# Altium schematic sheet eth_a.SchDoc: XMOS XS1-L1 DP83848C Ethernet PHY Prototype
size A3
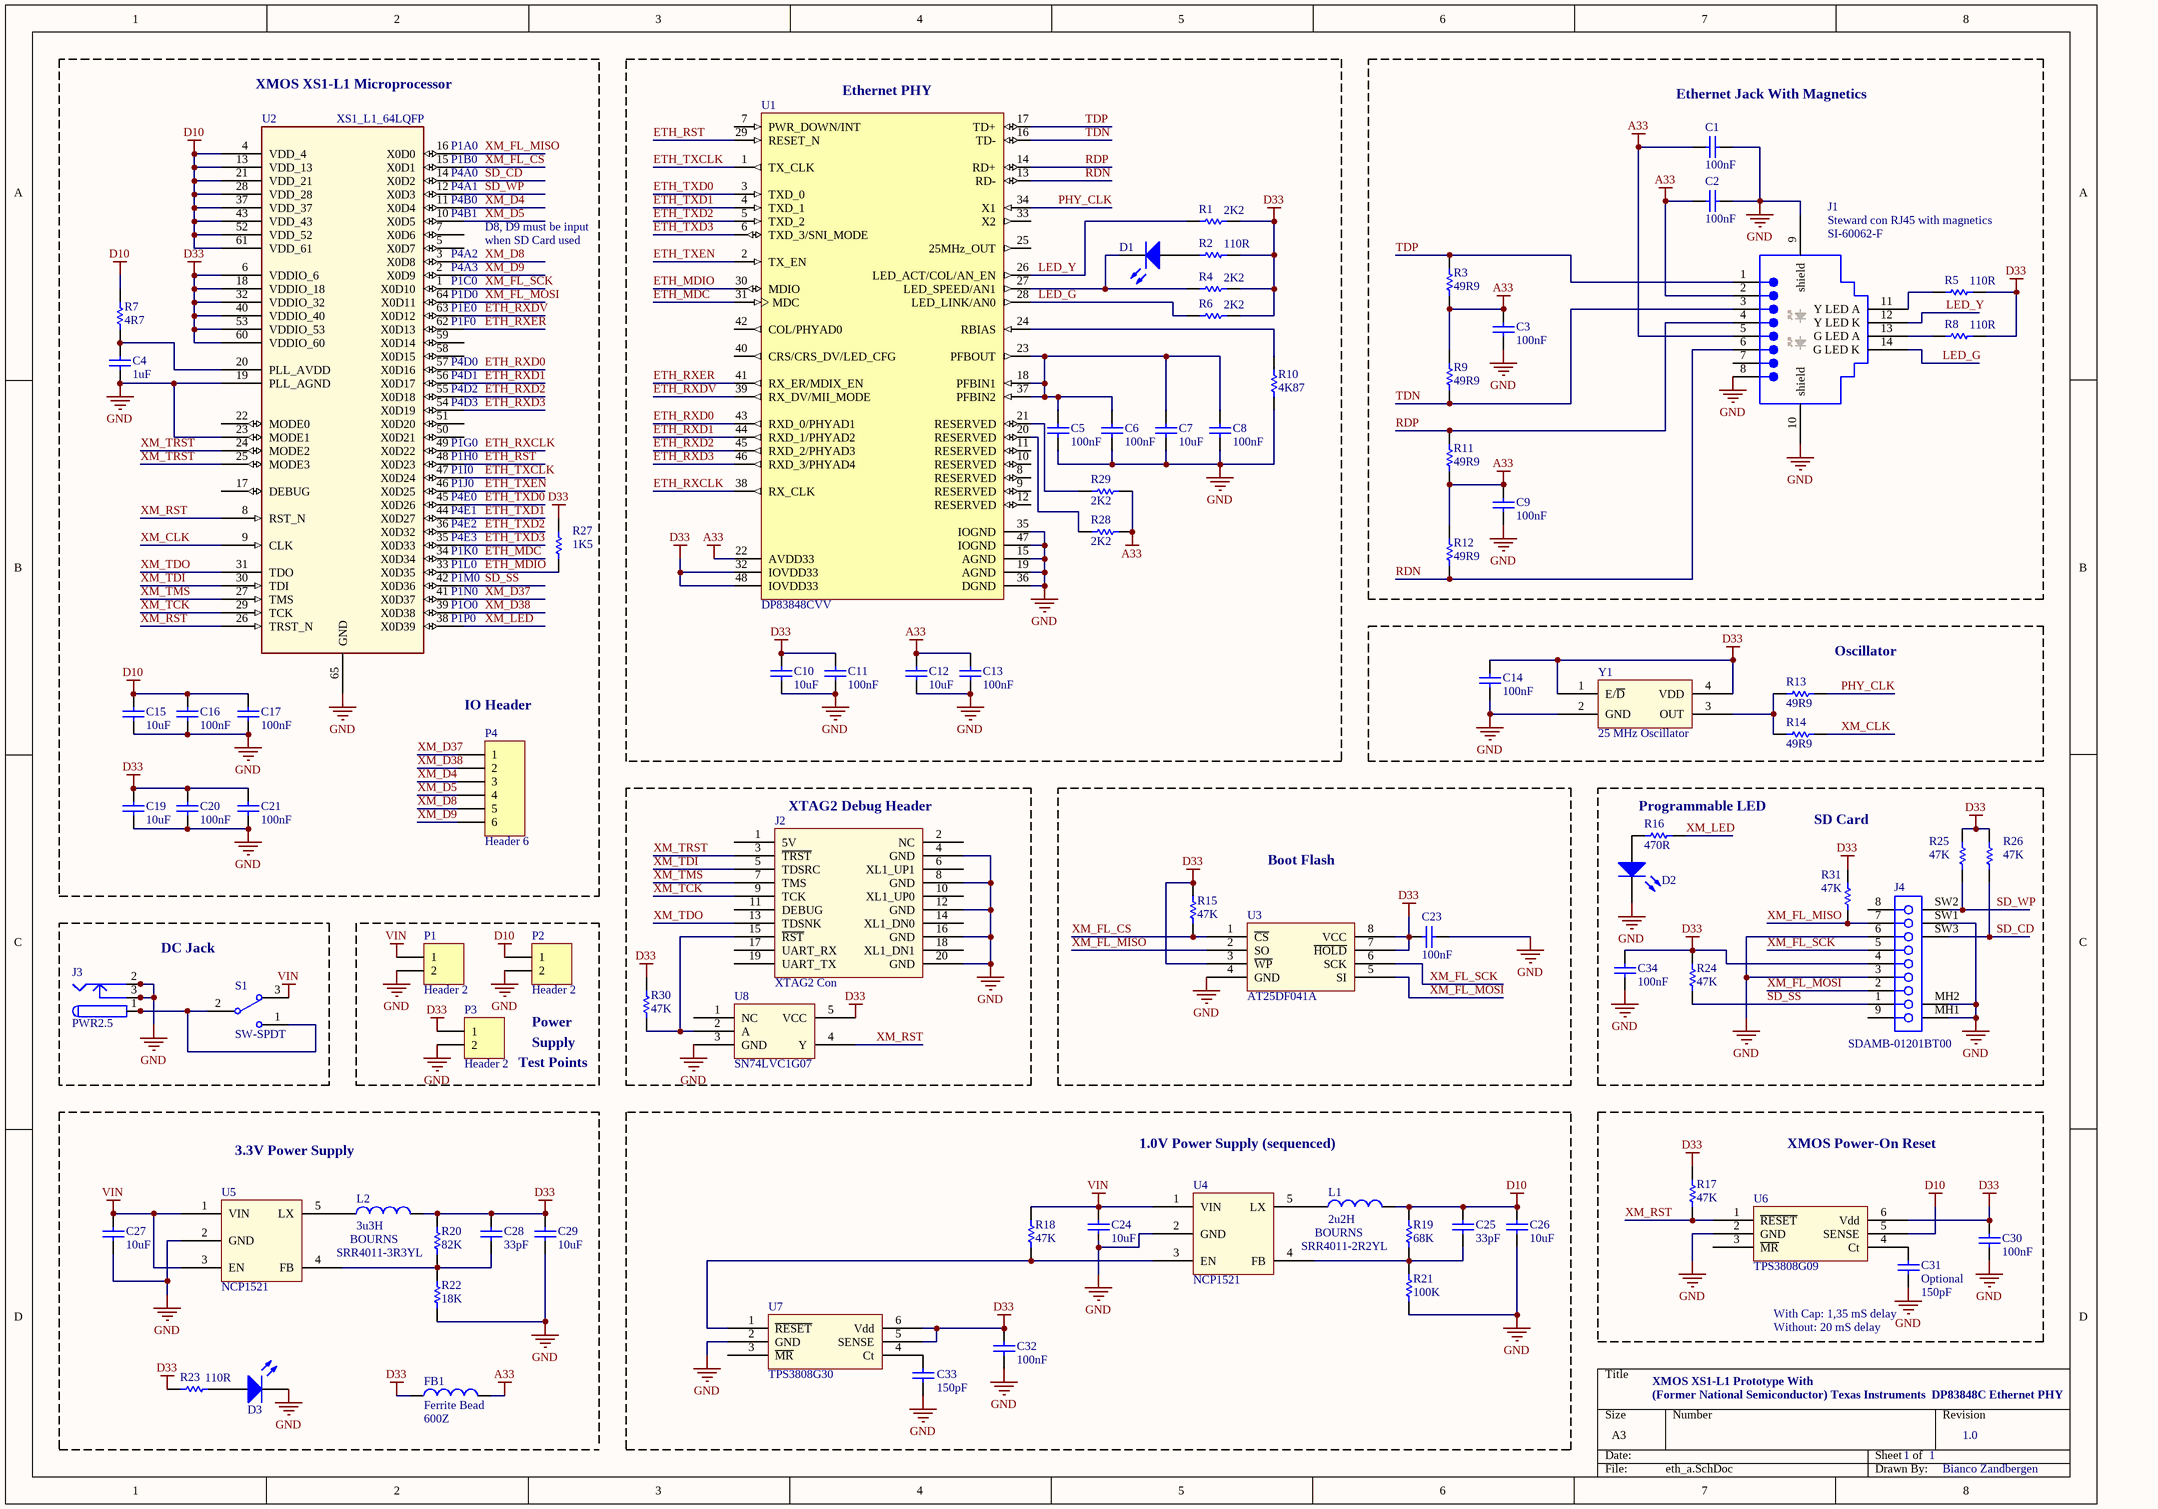
[diagram p0: eth_a.SchDoc]

## Parts
C1  value 100nF  [1608[0603]_CAP]  (hidden comment: Cap)
C2  value 100nF  [1608[0603]_CAP]  (hidden comment: Cap)
C3  value 100nF  [1608[0603]_CAP]  (hidden comment: Cap)
C4  value 1uF  [1608[0603]_CAP]  (hidden comment: Cap)
C5  value 100nF  [1608[0603]_CAP]  (hidden comment: Cap)
C6  value 100nF  [1608[0603]_CAP]  (hidden comment: Cap)
C7  value 10uF  [2012[0805]_CAP]  (hidden comment: Cap)
C8  value 100nF  [1608[0603]_CAP]  (hidden comment: Cap)
C9  value 100nF  [1608[0603]_CAP]  (hidden comment: Cap)
C10  value 10uF  [2012[0805]_CAP]  (hidden comment: Cap)
C11  value 100nF  [1608[0603]_CAP]  (hidden comment: Cap)
C12  value 10uF  [2012[0805]_CAP]  (hidden comment: Cap)
C13  value 100nF  [1608[0603]_CAP]  (hidden comment: Cap)
C14  value 100nF  [1608[0603]_CAP]  (hidden comment: Cap)
C15  value 10uF  [2012[0805]_CAP]  (hidden comment: Cap)
C16  value 100nF  [1608[0603]_CAP]  (hidden comment: Cap)
C17  value 100nF  [1608[0603]_CAP]  (hidden comment: Cap)
C19  value 10uF  [2012[0805]_CAP]  (hidden comment: Cap)
C20  value 100nF  [1608[0603]_CAP]  (hidden comment: Cap)
C21  value 100nF  [1608[0603]_CAP]  (hidden comment: Cap)
C23  value 100nF  [1608[0603]_CAP]  (hidden comment: Cap)
C24  value 10uF  [2012[0805]_CAP]  (hidden comment: Cap)
C25  value 33pF  [1608[0603]_CAP]  (hidden comment: Cap)
C26  value 10uF  [2012[0805]_CAP]  (hidden comment: Cap)
C27  value 10uF  [2012[0805]_CAP]  (hidden comment: Cap)
C28  value 33pF  [1608[0603]_CAP]  (hidden comment: Cap)
C29  value 10uF  [2012[0805]_CAP]  (hidden comment: Cap)
C30  value 100nF  [1608[0603]_CAP]  (hidden comment: Cap)
C31  Optional  value 150pF  [1608[0603]_CAP]
C32  value 100nF  [1608[0603]_CAP]  (hidden comment: Cap)
C33  value 150pF  [1608[0603]_CAP]  (hidden comment: Optional)
C34  value 100nF  [1608[0603]_CAP]  (hidden comment: Cap)
D1  LED3  [2012[0805]_LED]  (value not drawn)
D2  LED3  [2012[0805]_LED]  (value not drawn)
D3  LED3  [2012[0805]_LED]  (value not drawn)
FB1  Ferrite Bead  value 600Z  [1608[0603]_FB]
J1  Steward con RJ45 with magnetics  Details: SI-60062-F  [Steward Con RJ45]
J2  XTAG2 Con  [IDC2.54-V20D]
J3  PWR2.5  [KLD-0202]
J4  SDAMB-01201BT00  [SDCARD-SDAMB-012]
L1  value 2u2H  Manufacturer: BOURNS  ProductCode: SRR4011-2R2YL  [BOURNS_SRR4011]  (hidden comment: Inductor)
L2  value 3u3H  ProductCode: SRR4011-3R3YL  Manufacturer: BOURNS  [BOURNS_SRR4011]  (hidden comment: Inductor)
P1  Header 2  [HDR1X2]
P2  Header 2  [HDR1X2]
P3  Header 2  [HDR1X2]
P4  Header 6  [HDR1X6]
R1  value 2K2  [1608[0603]_RES]  (hidden comment: Res)
R2  value 110R  [1608[0603]_RES]  (hidden comment: Res)
R3  value 49R9  [1608[0603]_RES]  (hidden comment: Res)
R4  value 2K2  [1608[0603]_RES]  (hidden comment: Res)
R5  value 110R  [1608[0603]_RES]  (hidden comment: Res)
R6  value 2K2  [1608[0603]_RES]  (hidden comment: Res)
R7  value 4R7  [1608[0603]_RES]  (hidden comment: Res)
R8  value 110R  [1608[0603]_RES]  (hidden comment: Res)
R9  value 49R9  [1608[0603]_RES]  (hidden comment: Res)
R10  value 4K87  [1608[0603]_RES]  (hidden comment: Res)
R11  value 49R9  [1608[0603]_RES]  (hidden comment: Res)
R12  value 49R9  [1608[0603]_RES]  (hidden comment: Res)
R13  value 49R9  [1608[0603]_RES]  (hidden comment: Res)
R14  value 49R9  [1608[0603]_RES]  (hidden comment: Res)
R15  value 47K  [1608[0603]_RES]  (hidden comment: Res)
R16  value 470R  [1608[0603]_RES]  (hidden comment: Res)
R17  value 47K  [1608[0603]_RES]  (hidden comment: Res)
R18  value 47K  [1608[0603]_RES]  (hidden comment: Res)
R19  value 68K  [1608[0603]_RES]  (hidden comment: Res)
R20  value 82K  [1608[0603]_RES]  (hidden comment: Res)
R21  value 100K  [1608[0603]_RES]  (hidden comment: Res)
R22  value 18K  [1608[0603]_RES]  (hidden comment: Res)
R23  value 110R  [1608[0603]_RES]  (hidden comment: Res)
R24  value 47K  [1608[0603]_RES]  (hidden comment: Res)
R25  value 47K  [1608[0603]_RES]  (hidden comment: Res)
R26  value 47K  [1608[0603]_RES]  (hidden comment: Res)
R27  value 1K5  [1608[0603]_RES]  (hidden comment: Res)
R28  value 2K2  [1608[0603]_RES]  (hidden comment: Res)
R29  value 2K2  [1608[0603]_RES]  (hidden comment: Res)
R30  value 47K  [1608[0603]_RES]  (hidden comment: Res)
R31  value 47K  [1608[0603]_RES]  (hidden comment: Res)
S1  SW-SPDT  [SIP-3]
U1  DP83848CVV  [TSQFP50P900X900-48M]
U2  XS1_L1_64LQFP  [XMOS_QFP50P1200X1200X160-65N]
U3  AT25DF041A  [SOIC150-8_M]
U4  NCP1521  [SOT23-5]
U5  NCP1521  [SOT23-5]
U6  TPS3808G09  [SOT23-6]
U7  TPS3808G30  [SOT23-6]
U8  SN74LVC1G07  [SOT23-5]
Y1  25 MHz Oscillator  [OSC_32_50]

## Blocks framed on the sheet
Ethernet PHY: C5-C8 C10-C13 D1 R1 R2 R4 R6 R10 R28 R29 U1
Ethernet Jack With Magnetics: C1-C3 C9 J1 R3 R5 R8 R9 R11 R12
Oscillator: C14 R13 R14 Y1
XTAG2 Debug Header: J2 R30 U8
Boot Flash: C23 R15 U3
DC Jack: J3 S1
1.0V Power Supply (sequenced): C24-C26 C32 C33 L1 R18 R19 R21 U4 U7
XMOS Power-On Reset: C30 C31 R17 U6

## Nets
A33: C1.2 C2.2 C3.2 C9.2 C12.2 C13.2 FB1.2 J1.2 J1.5 R3.1 R9.2 R11.1 R12.2 R28.2 R29.2 U1.22(AVDD33)
D10: C15.2 C16.2 C17.2 C25.2 C26.2 L1.2 P2.1 R7.2 R19.2 U2.4(VDD_4) U2.13(VDD_13) U2.21(VDD_21) U2.28(VDD_28) U2.37(VDD_37) U2.43(VDD_43) U2.52(VDD_52) U2.61(VDD_61) U6.5(SENSE)
D33: C10.2 C11.2 C14.2 C19.2 C20.2 C21.2 C23.2 C28.2 C29.2 C30.2 C32.2 C34.2 FB1.1 J4.4 L2.2 P3.1 R1.2 R2.2 R4.2 R5.2 R6.2 R8.2 R15.2 R17.2 R20.2 R23.1 R24.2 R25.2 R26.2 R27.2 R30.2 R31.2 U1.32(IOVDD33) U1.48(IOVDD33) U2.6(VDDIO_6) U2.18(VDDIO_18) U2.32(VDDIO_32) U2.40(VDDIO_40) U2.53(VDDIO_53) U2.60(VDDIO_60) U3.3(~{WP}) U3.7(~{HOLD}) U3.8(VCC) U6.6(Vdd) U7.5(SENSE) U7.6(Vdd) U8.5(VCC) Y1.1(E/~{D}) Y1.4(VDD)
GND: C1.1 C2.1 C3.1 C4.1 C5.1 C6.1 C7.1 C8.1 C9.1 C10.1 C11.1 C12.1 C13.1 C14.1 C15.1 C16.1 C17.1 C19.1 C20.1 C21.1 C23.1 C24.1 C26.1 C27.1 C29.1 C30.1 C31.1 C32.1 C33.1 C34.1 D2.2(K) D3.2(K) J1.8 J1.9(shield) J1.10(shield) J2.4(GND) J2.8(GND) J2.12(GND) J2.16(GND) J2.20(GND) J3.2 J3.2A J3.2B J3.3 J3.3A J3.3B J4.3 J4.6 J4.MH1 J4.MH2 J4.SW1 P1.2 P2.2 P3.2 R10.1 R21.1 R22.1 U1.15(AGND) U1.19(AGND) U1.35(IOGND) U1.36(DGND) U1.47(IOGND) U2.19(PLL_AGND) U2.23(MODE1) U2.65(GND) U3.4(GND) U4.2(GND) U5.2(GND) U6.2(GND) U7.2(GND) U8.3(GND) Y1.2(GND)
VIN: C24.2 C27.2 P1.1 R18.2 S1.3 U4.1(VIN) U5.1(VIN) U5.3(EN)
ETH_MDC: U1.31(MDC) U2.34(X0D34)
ETH_MDIO: R27.1 U1.30(MDIO) U2.33(X0D35)
ETH_RST: U1.29(RESET_N) U2.48(X0D23)
ETH_RXCLK: U1.38(RX_CLK) U2.49(X0D22)
ETH_RXD0: U1.43(RXD_0/PHYAD1) U2.57(X0D16)
ETH_RXD1: U1.44(RXD_1/PHYAD2) U2.56(X0D17)
ETH_RXD2: U1.45(RXD_2/PHYAD3) U2.55(X0D18)
ETH_RXD3: U1.46(RXD_3/PHYAD4) U2.54(X0D19)
ETH_RXDV: U1.39(RX_DV/MII_MODE) U2.63(X0D12)
ETH_RXER: U1.41(RX_ER/MDIX_EN) U2.62(X0D13)
ETH_TXCLK: U1.1(TX_CLK) U2.47(X0D24)
ETH_TXD0: U1.3(TXD_0) U2.45(X0D26)
ETH_TXD1: U1.4(TXD_1) U2.44(X0D27)
ETH_TXD2: U1.5(TXD_2) U2.36(X0D32)
ETH_TXD3: U1.6(TXD_3/SNI_MODE) U2.35(X0D33)
ETH_TXEN: U1.2(TX_EN) U2.46(X0D25)
LED_G: J1.14(G_LED_K) R6.1 U1.28(LED_LINK/AN0)
LED_Y: J1.12(Y_LED_K) R1.1 U1.26(LED_ACT/COL/AN_EN)
PHY_CLK: R13.1 U1.34(X1)
RDN: J1.6 R12.1 U1.13(RD-)
RDP: J1.4 R11.2 U1.14(RD+)
SD_CD: J4.SW3 R26.1 U2.14(X0D2)
SD_SS: J4.1 R24.1 U2.42(X0D36)
SD_WP: J4.SW2 R25.1 U2.12(X0D3)
TDN: J1.3 R9.1 U1.16(TD-)
TDP: J1.1 R3.2 U1.17(TD+)
XM_CLK: R14.1 U2.9(CLK)
XM_D4: P4.3 U2.11(X0D4)
XM_D5: P4.4 U2.10(X0D5)
XM_D8: P4.5 U2.3(X0D8)
XM_D9: P4.6 U2.2(X0D9)
XM_D37: P4.1 U2.41(X0D37)
XM_D38: P4.2 U2.39(X0D38)
XM_FL_CS: R15.1 U2.15(X0D1) U3.1(~{CS})
XM_FL_MISO: J4.7 R31.1 U2.16(X0D0) U3.2(SO)
XM_FL_MOSI: J4.2 U2.64(X0D11) U3.5(SI)
XM_FL_SCK: J4.5 U2.1(X0D10) U3.6(SCK)
XM_LED: R16.1 U2.38(X0D39)
XM_RST: R17.1 U2.8(RST_N) U2.26(TRST_N) U6.1(~{RESET}) U8.4(Y)
XM_TCK: J2.9(TCK) U2.29(TCK)
XM_TDI: J2.5(TDSRC) U2.30(TDI)
XM_TDO: J2.13(TDSNK) U2.31(TDO)
XM_TMS: J2.7(TMS) U2.27(TMS)
XM_TRST: J2.3(~{TRST}) U2.24(MODE2) U2.25(MODE3)
NetC4_2: C4.2 R7.1 U2.20(PLL_AVDD)
NetC5_2: C5.2 C6.2 C7.2 C8.2 U1.18(PFBIN1) U1.23(PFBOUT) U1.37(PFBIN2)
NetC25_1: C25.1 R19.1 R21.2 U4.4(FB)
NetC28_1: C28.1 R20.1 R22.2 U5.4(FB)
NetC31_2: C31.2 U6.4(Ct)
NetC33_2: C33.2 U7.4(Ct)
NetD1_1: D1.1(A) R2.1
NetD1_2: D1.2(K) R4.1 U1.27(LED_SPEED/AN1)
NetD2_1: D2.1(A) R16.2
NetD3_1: D3.1(A) R23.2
NetJ1_11: J1.11(Y_LED_A) R5.1
NetJ1_13: J1.13(G_LED_A) R8.1
NetJ2_15: J2.15(~{RST}) R30.1 U8.2(A)
NetJ3_1: J3.1 J3.1A J3.1B S1.1 S1.2
NetL1_1: L1.1 U4.5(LX)
NetL2_1: L2.1 U5.5(LX)
NetR10_2: R10.2 U1.24(RBIAS)
NetR13_2: R13.2 R14.2 Y1.3(OUT)
NetR18_1: R18.1 U4.3(EN) U7.1(~{RESET})
NetR28_1: R28.1 U1.20(RESERVED)
NetR29_1: R29.1 U1.21(RESERVED)

Not connected (* = marked no-connect by the designer): J1 7; J2 1(5V) 2(NC) 6(XL1_UP1) 10(XL1_UP0) 11(DEBUG) 14(XL1_DN0) 17(UART_RX) 18(XL1_DN1) 19(UART_TX); J4 8 9; U1 7(PWR_DOWN/INT) 8(RESERVED) 9(RESERVED) 10(RESERVED) 11(RESERVED) 12(RESERVED) 25(25MHz_OUT) 33(X2) 40(CRS/CRS_DV/LED_CFG) 42(COL/PHYAD0); U2 5(X0D7) 7(X0D6) 17(DEBUG) 22(MODE0) 50(X0D21) 51(X0D20) 58(X0D15) 59(X0D14); U6 3(~{MR}); U7 3(~{MR}); U8 1(NC)

## Notes on the sheet
- XMOS XS1-L1 Microprocessor
- (near U2) P1A0
- (near U2) P1B0
- (near U2) P4A0
- (near U2) P4A1
- (near U2) P4B0
- (near U2) P4B1
- D8, D9 must be input
- when SD Card used
- (near U2) P1E0
- (near U2) P1C0
- (near U2) P1D0
- (near U2) P4A2
- (near U2) P4A3
- (near U2) P1F0
- (near U2) P4D0
- (near U2) P4D1
- (near U2) P4D2
- (near U2) P4D3
- (near U2) P1G0
- (near U2) P1H0
- (near U2) P1I0
- (near U2) P1J0
- (near U2) P4E0
- (near U2) P4E1
- (near U2) P4E2
- (near U2) P4E3
- (near U2) P1K0
- (near U2) P1L0
- (near U2) P1M0
- (near U2) P1P0
- (near U2) P1N0
- (near U2) P1O0
- IO Header
- (near R16) Programmable LED
- SD Card
- Power
- Supply
- Test Points
- 3.3V Power Supply
- (near C31) With Cap: 1,35 mS delay
- XMOS XS1-L1 Prototype With
- (Former National Semiconductor) Texas Instruments  DP83848C Ethernet PHY
- Without: 20 mS delay
- 1
- 1.0
- Bianco Zandbergen

## Library data of the parts
C1-C3 C5-C14 C17 C19-C21 C23-C27 C29 C30 C32-C34 = Cap: Capacitor; Published: 8-Jun-2000; LatestRevisionDate: 17-Jul-2002; LatestRevisionNote: Re-released for DXP Platform.; PackageReference: RAD-0.3; Publisher: Altium Limited
C4 = Cap: Capacitor; Manufacturer: KEMET; ProductCode: C0603C105K4RACTU; Vendor: Farnell; VendorCode: 1650837; Published: 8-Jun-2000; LatestRevisionDate: 17-Jul-2002; LatestRevisionNote: Re-released for DXP Platform.; PackageReference: RAD-0.3; Publisher: Altium Limited; Price: 0,17
C15 = Cap: Capacitor; Manufacturer: AVX; ProductCode: 0805ZD106KAT2A; Vendor: Farnell; VendorCode: 1833812; Published: 8-Jun-2000; LatestRevisionDate: 17-Jul-2002; LatestRevisionNote: Re-released for DXP Platform.; PackageReference: RAD-0.3; Publisher: Altium Limited; Price: 0,12
C16 = Cap: Capacitor; Manufacturer: MURATA; ProductCode: GRM188R71H104KA93D; Vendor: Farnell; VendorCode: 8820023; Published: 8-Jun-2000; LatestRevisionDate: 17-Jul-2002; LatestRevisionNote: Re-released for DXP Platform.; PackageReference: RAD-0.3; Publisher: Altium Limited; Price: 0,05
C28 = Cap: Capacitor; Manufacturer: MURATA; ProductCode: GRM1885C1H330JA01D; Vendor: Farnell; VendorCode: 1828910; Published: 8-Jun-2000; LatestRevisionDate: 17-Jul-2002; LatestRevisionNote: Re-released for DXP Platform.; PackageReference: RAD-0.3; Publisher: Altium Limited; Price: 0,03
C31 = Cap: Capacitor; Manufacturer: MURATA; ProductCode: GRM1885C1H151JA01D; Vendor: Farnell; VendorCode: 8819874; Published: 8-Jun-2000; LatestRevisionDate: 17-Jul-2002; LatestRevisionNote: Re-released for DXP Platform.; PackageReference: RAD-0.3; Publisher: Altium Limited; Price: 0,05
D1 = LED3: SMD LED 0805; Manufacturer: KINGBRIGHT; Value: ORANGE; ProductCode: KPHCM-2012SECK; Vendor: Farnell; VendorCode: 1686068; Published: 8-Jun-2000; LatestRevisionDate: 17-Dec-2003; LatestRevisionNote: PCB Footprint replaced.; DatasheetVersion: 16-Apr-2002; PackageVersion: 16-Apr-2002; PackageReference: 3.5X2.8X1.9; Publisher: Altium Limited; Price: 0,16
D2 = LED3: SMD LED 0805; Value: ORANGE; Published: 8-Jun-2000; LatestRevisionDate: 17-Dec-2003; LatestRevisionNote: PCB Footprint replaced.; DatasheetVersion: 16-Apr-2002; PackageVersion: 16-Apr-2002; PackageReference: 3.5X2.8X1.9; Publisher: Altium Limited
D3 = LED3: SMD LED 0805; Manufacturer: KINGBRIGHT; Value: GREEN; ProductCode: KPHCM-2012SGC-T; Vendor: Farnell; VendorCode: 1686074; Published: 8-Jun-2000; LatestRevisionDate: 17-Dec-2003; LatestRevisionNote: PCB Footprint replaced.; DatasheetVersion: 16-Apr-2002; PackageVersion: 16-Apr-2002; PackageReference: 3.5X2.8X1.9; Publisher: Altium Limited; Price: 0,16
FB1 = Ferrite Bead: Manufacturer: MURATA; Code_IEC: 1005; ProductCode: BLM18AG601SN1D; Vendor: Farnell; VendorCode: 1515679; Published: 8-Jun-2000; LatestRevisionDate: 29-May-2009; LatestRevisionNote: IPC-7351 Footprint Added.; PackageReference: 0402-A; Publisher: Altium Limited; PackageDescription: Chip Inductor; Code_JEITA: 0402; Price: 0,06
J1 = Steward con RJ45 with magnetics: Right Angle,RJ45-Keyed, Flange Mount PCB Jack; Manufacturer: STEWART CONNECTOR; Ports: 1; Positions/Loaded: Port1 - 8 Keyed/8; PerformanceCategory: 3; PCB_Mounting: Thru-Hole; ComponentAvailability: Obsolete; DrillSize: Nominal, Rounded to nearest 0.05mm; PCB_Layout: Complies with Manufacturer's Recommendation.; Vendor: Farnell; VendorCode: 1137983; Published: 25-Jun-2002; DatasheetDocument: 18-Dec-2001; PackageDocument: 18-Dec-2001; PackageReference: 15-43-6233; Publisher: Altium Limited; ComponentLink1Description: Manufacturer Link; ComponentLink1URL: http://www.molex.com/; ComponentLink2Description: Datasheet; ComponentLink2URL: http://www.molex.com/cmc_upload/common_files/1212003_catalogmx41314.pdf; ComponentLink3Description: Iges Model; ComponentLink3URL: http://www.molex.com/pdm_docs/igs/15-43-6233_igs.zip; ProductCode: SI-60062-F; Price: 5,21
J2 = XTAG2_CON: XTAG2 Connector; Manufacturer: TYCO; ProductCode: 2-1634688-0; Vendor: Farnell; VendorCode: 8395942; Price: 0,91
J3 = PWR2.5: Low Voltage Power Supply Connector; Manufacturer: SWITCHCRAFT; ProductCode: RAPC722X; Vendor: Farnell; VendorCode: 1608727; Published: 17-Dec-2003; DatasheetDocument: 09-May-2002; Publisher: Altium Limited; ComponentLink1Description: Manufacturer Link; ComponentLink1URL: http://domino.kycon.com/internet/Products.html; Price: 1,58
J4 = SDAMB-01201BT00: Secure Digital Card Connector, Type A without Cover; Manufacturer: MULTICOMP; PCB_Layout: Complies with manufacturer's recommendation.; Note: SD and MMC full compatible; ProductCode: SDAMB-01215BT00; Vendor: Farnell; VendorCode: 9186140; Published: 21-Sep-2007; DatasheetVersion: rev.I, 2006; PackageVersion: 2006; PackageReference: SDAMB-012; Publisher: Altium Limited; PackageDescription: SD Card without Cover, SM, 9 Position, Right Angle, Body 23.3 x 27.4 x 3.4 mm (LxWxH); ComponentLink1Description: Manufacturer Link; ComponentLink1URL: http://www.kingfont.com/; ComponentLink2Description: Datasheet; ComponentLink2URL: http://php2.twinner.com.tw/files/kingfont/SDAMB-012XXBXXX-1C.pdf; Price: 1,60
L1 = Inductor: Code_IEC: 1005; Details: BOURNS SRR4011-2R2YL; Vendor: Farnell; VendorCode: 1828153; Published: 8-Jun-2000; LatestRevisionDate: 29-May-2009; LatestRevisionNote: IPC-7351 Footprint Added.; PackageReference: 0402-A; Publisher: Altium Limited; PackageDescription: Chip Inductor; Code_JEITA: 0402; Price: 1,04
L2 = Inductor: Code_IEC: 1005; Details: BOURNS SRR4011-3R3YL; Vendor: Farnell; VendorCode: 1828154; Published: 8-Jun-2000; LatestRevisionDate: 29-May-2009; LatestRevisionNote: IPC-7351 Footprint Added.; PackageReference: 0402-A; Publisher: Altium Limited; PackageDescription: Chip Inductor; Code_JEITA: 0402; Price: 0,27
P1-P3 = Header 2: Header, 2-Pin; LatestRevisionDate: 17-Jul-2002; LatestRevisionNote: Re-released for DXP Platform.; Publisher: Altium Limited
  P1: Price: 0,00
P4 = Header 6: Header, 6-Pin; LatestRevisionDate: 17-Jul-2002; LatestRevisionNote: Re-released for DXP Platform.; Publisher: Altium Limited; Price: 0,00
R1 = Res: Resistor; Manufacturer: YAGEO; ProductCode: RE0603DR-072K2L; Vendor: Farnell; VendorCode: 1840583; Published: 8-Jun-2000; LatestRevisionDate: 17-Jul-2002; LatestRevisionNote: Re-released for DXP Platform.; PackageReference: AXIAL-0.3; Publisher: Altium Limited; Price: 0,01
R2 R4 R6 R8 R9 R11-R14 R17 R18 R23-R26 R28-R31 = Res: Resistor; Published: 8-Jun-2000; LatestRevisionDate: 17-Jul-2002; LatestRevisionNote: Re-released for DXP Platform.; PackageReference: AXIAL-0.3; Publisher: Altium Limited
R3 = Res: Resistor; Manufacturer: SUSUMU; ProductCode: RR0816Q-49R9-D-68R; Vendor: Farnell; VendorCode: 1612045; Published: 8-Jun-2000; LatestRevisionDate: 17-Jul-2002; LatestRevisionNote: Re-released for DXP Platform.; PackageReference: AXIAL-0.3; Publisher: Altium Limited; Price: 0,02
R5 = Res: Resistor; Manufacturer: PANASONIC; ProductCode: ERJ3GEYJ111V; Vendor: Farnell; VendorCode: 2059576; Published: 8-Jun-2000; LatestRevisionDate: 17-Jul-2002; LatestRevisionNote: Re-released for DXP Platform.; PackageReference: AXIAL-0.3; Publisher: Altium Limited; Price: 0,01
R7 = Res: Resistor; Manufacturer: PANASONIC; ProductCode: ERJ3GEYJ4R7V; Vendor: Farnell; VendorCode: 2059539; Published: 8-Jun-2000; LatestRevisionDate: 17-Jul-2002; LatestRevisionNote: Re-released for DXP Platform.; PackageReference: AXIAL-0.3; Publisher: Altium Limited; Price: 0,01
R10 = Res: Resistor; Manufacturer: MULTICOMP; ProductCode: MC 0.063W 0603 1%; Vendor: Farnell; VendorCode: 1170858; Published: 8-Jun-2000; LatestRevisionDate: 17-Jul-2002; LatestRevisionNote: Re-released for DXP Platform.; PackageReference: AXIAL-0.3; Publisher: Altium Limited; Price: 0,02
R15 = Res: Resistor; Manufacturer: VISHAY DRALORIC; ProductCode: CRCW060347K0FKEA; Vendor: Farnell; VendorCode: 1469811; Published: 8-Jun-2000; LatestRevisionDate: 17-Jul-2002; LatestRevisionNote: Re-released for DXP Platform.; PackageReference: AXIAL-0.3; Publisher: Altium Limited; Price: 0,02
R16 = Res: Resistor; Manufacturer: BOURNS; ProductCode: CR0603-JW-471GLF; Vendor: Farnell; VendorCode: 2008354; Published: 8-Jun-2000; LatestRevisionDate: 17-Jul-2002; LatestRevisionNote: Re-released for DXP Platform.; PackageReference: AXIAL-0.3; Publisher: Altium Limited; Price: 0,02
R19 = Res: Resistor; Manufacturer: PANASONIC; ProductCode: CRCW060368K0FKEA; Vendor: Farnell; VendorCode: 1469832; Published: 8-Jun-2000; LatestRevisionDate: 17-Jul-2002; LatestRevisionNote: Re-released for DXP Platform.; PackageReference: AXIAL-0.3; Publisher: Altium Limited; Price: 0,02
R20 = Res: Resistor; Manufacturer: VISHAY DRALORIC; ProductCode: CRCW060382K0FKEAHP; Vendor: Farnell; VendorCode: 1738930; Published: 8-Jun-2000; LatestRevisionDate: 17-Jul-2002; LatestRevisionNote: Re-released for DXP Platform.; PackageReference: AXIAL-0.3; Publisher: Altium Limited; Price: 0,04
R21 = Res: Resistor; Manufacturer: VISHAY DRALORIC; ProductCode: CRCW0603100KFKEA; Vendor: Farnell; VendorCode: 1469649; Published: 8-Jun-2000; LatestRevisionDate: 17-Jul-2002; LatestRevisionNote: Re-released for DXP Platform.; PackageReference: AXIAL-0.3; Publisher: Altium Limited; Price: 0,02
R22 = Res: Resistor; Manufacturer: VISHAY DRALORIC; ProductCode: CRCW060318K0FKEAHP; Vendor: Farnell; VendorCode: 1738921; Published: 8-Jun-2000; LatestRevisionDate: 17-Jul-2002; LatestRevisionNote: Re-released for DXP Platform.; PackageReference: AXIAL-0.3; Publisher: Altium Limited; Price: 0,04
R27 = Res: Resistor; Manufacturer: PANASONIC; ProductCode: ERJ3GEYJ152V; Vendor: Farnell; VendorCode: 2059606; Published: 8-Jun-2000; LatestRevisionDate: 17-Jul-2002; LatestRevisionNote: Re-released for DXP Platform.; PackageReference: AXIAL-0.3; Publisher: Altium Limited; Price: 0,01
S1 = SW-SPDT: SPDT Switch; Manufacturer: EAO; ProductCode: 09.03201.02; Vendor: Farnell; VendorCode: 1608080; Published: 24-Mar-1999; LatestRevisionDate: 17-Dec-2003; LatestRevisionNote: Schematic revised, PCB Footprint replaced.; DatasheetVersion: 05-Dec-2000; PackageReference: TL36WW15050; Publisher: Altium Limited; PackageDescription: Switch; 4 Leads; ComponentLink1Description: Manufacturer Link; ComponentLink1URL: http://www.apem.com; Price: 1,00
U1 = DP83848CVV: Single Port 10/100 Mb/s Ethernet PHY; Manufacturer: National Semiconductor; PackageTopMarking: NSUZXYTT*DP83848VV*VBC; PowerWise: N; CompType: Interface IC; Vendor: Farnell; VendorCode: 1286816; Published: 4-Dec-2008; DatasheetVersion: May-2008; PackageVersion: revE, May-2007; PackageReference: VBH48A; Publisher: Altium Limited; PackageDescription: LQFP, 7 x 7 x 1.4mm, 48 Lead, 0.5mm Pitch; Supplier 1: Farnell; Supplier Part Number 1: 1286816; Supplier 2: Farnell; Supplier Part Number 2: 1528379; PartNumber: DP83848CVV; RoHS: Y; PinCount: 48; ComponentLink1Description: DP83848C Datasheet; ComponentLink1URL: http://www.national.com/ds/DP/DP83848C.pdf; ComponentLink2Description: DP83848C Web Page; ComponentLink2URL: http://www.national.com/pf/DP/DP83848C.html; ComponentLink3Description: VBH48A Package Page; ComponentLink3URL: http://www.national.com/packaging/folders/vbh48a.html; ProductCode: DP83848CVV; Price: 4,89
U2 = XS1_L1_64LQFP: XMOS XS1-L1 Microprocessor; ProductCode: XS1-L01A-LQ64-C5; Vendor: Digikey; VendorCode: 880-1032-ND; Manufacturer: XMOS; Price: 6,65
U3 = AT25DF041A: 4Mbit SPI Flash; Manufacturer: ATMEL; ProductCode: AT25DF041A-SSH-B; Vendor: Farnell; VendorCode: 1715441; Price: 1,60
U4 = NCP1521: Buck Converter
U5 = NCP1521: Buck Converter; Manufacturer: ON SEMICONDUCTOR; ProductCode: NCP1521BSNT1G; Vendor: Farnell; VendorCode: 1432258; Price: 1,58
U6 = TPS3808G09: Power on Reset controller 0.9V; Manufacturer: TEXAS INSTRUMENTS; ProductCode: TPS3808G09DBVT; Vendor: Farnell; VendorCode: 1755527; Price: 2,45
U7 = TPS3808G30: Power on Reset controller 3.0V; Manufacturer: TEXAS INSTRUMENTS; ProductCode: TPS3808G30DBVT; Vendor: Farnell; VendorCode: 1755533; Price: 2,45
U8 = SN74LVC1G07: Buffer (open drain output); Manufacturer: TEXAS INSTRUMENTS; Vendor: Farnell; ProductCode: SN74LVC1G07DBV; VendorCode: 1102969; Price: 0,47
Y1 = oscillator: Crystal Oscillator SMD 5mm x 3.2mm; Manufacturer: TXC; ProductCode: 7C-25.000MBB-T; Vendor: Farnell; VendorCode: 1842032; Value: 25 MHz; Price: 3,21